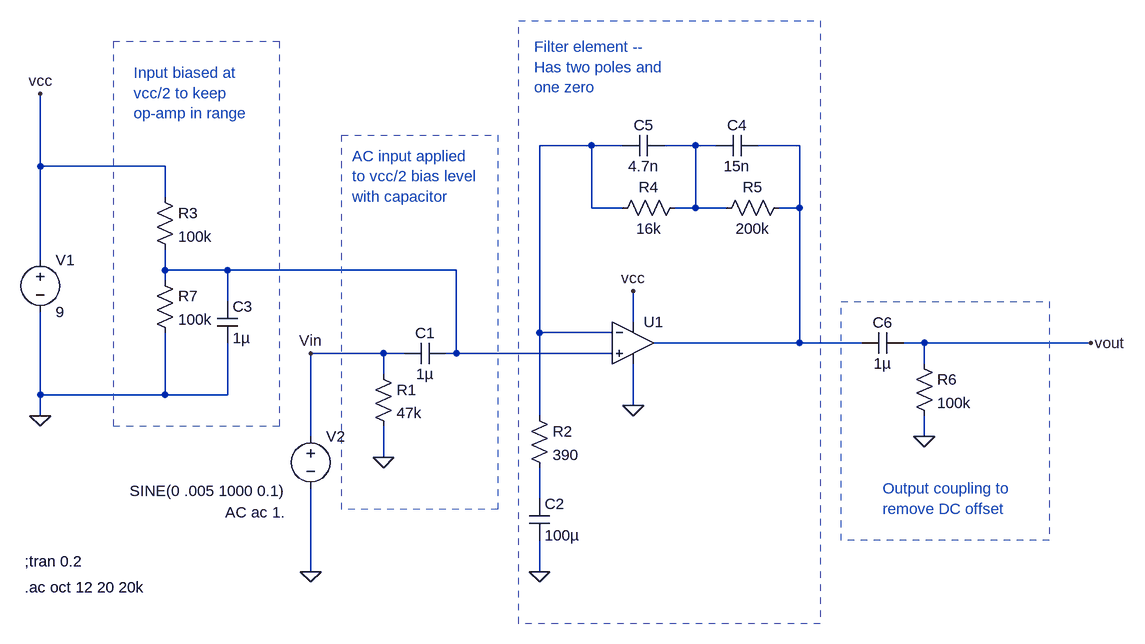
[diagram p0: schematic an-346-noninvert_notated.asc]
an-346-noninvert_notated.asc, the LTspice schematic file:
Version 4
SHEET 1 1740 680
WIRE 672 -256 592 -256
WIRE 720 -256 672 -256
WIRE 832 -256 784 -256
WIRE 864 -256 832 -256
WIRE 992 -256 928 -256
WIRE -176 -224 -176 -336
WIRE 16 -224 -176 -224
WIRE 16 -176 16 -224
WIRE 672 -160 672 -256
WIRE 720 -160 672 -160
WIRE 832 -160 832 -256
WIRE 832 -160 800 -160
WIRE 880 -160 832 -160
WIRE 992 -160 992 -256
WIRE 992 -160 960 -160
WIRE -176 -80 -176 -224
WIRE 16 -64 16 -96
WIRE 112 -64 16 -64
WIRE 464 -64 112 -64
WIRE 16 -48 16 -64
WIRE 112 -16 112 -64
WIRE 736 16 736 -32
WIRE 592 32 592 -256
WIRE 704 32 592 32
WIRE 992 48 992 -160
WIRE 992 48 768 48
WIRE 1088 48 992 48
WIRE 1184 48 1152 48
WIRE 1440 48 1184 48
WIRE 352 64 240 64
WIRE 384 64 352 64
WIRE 464 64 464 -64
WIRE 464 64 448 64
WIRE 704 64 464 64
WIRE 1184 80 1184 48
WIRE 352 96 352 64
WIRE -176 128 -176 0
WIRE 16 128 16 32
WIRE 16 128 -176 128
WIRE 112 128 112 48
WIRE 112 128 16 128
WIRE 736 144 736 80
WIRE 752 144 736 144
WIRE -176 160 -176 128
WIRE 592 160 592 32
WIRE 240 192 240 64
WIRE 1184 192 1184 160
WIRE 352 224 352 176
WIRE 592 288 592 240
WIRE 240 400 240 272
WIRE 592 400 592 352
FLAG -176 160 0
FLAG 240 400 0
FLAG 736 -32 vcc
FLAG -176 -336 vcc
FLAG 352 224 0
FLAG 592 400 0
FLAG 1184 192 0
FLAG 1440 48 vout
FLAG 240 64 Vin
FLAG 736 144 0
SYMBOL voltage -176 -96 R0
WINDOW 123 0 0 Left 2
WINDOW 39 0 0 Left 2
SYMATTR InstName V1
SYMATTR Value 9
SYMBOL voltage 240 176 R0
WINDOW 123 -39 133 Right 2
WINDOW 39 24 152 Left 2
WINDOW 3 -38 100 Right 2
SYMATTR Value2 AC ac 1.
SYMATTR InstName V2
SYMATTR Value SINE(0 .005 1000 0.1)
SYMBOL Opamps\\UniversalOpamp2 736 48 R0
SYMATTR InstName U1
SYMBOL res 336 80 R0
SYMATTR InstName R1
SYMATTR Value 47k
SYMBOL res 576 144 R0
SYMATTR InstName R2
SYMATTR Value 390
SYMBOL res 816 -176 R90
WINDOW 0 0 56 VBottom 2
WINDOW 3 32 56 VTop 2
SYMATTR InstName R4
SYMATTR Value 16k
SYMBOL res 976 -176 R90
WINDOW 0 0 56 VBottom 2
WINDOW 3 32 56 VTop 2
SYMATTR InstName R5
SYMATTR Value 200k
SYMBOL cap 576 288 R0
SYMATTR InstName C2
SYMATTR Value 100µ
SYMBOL cap 928 -272 R90
WINDOW 0 0 32 VBottom 2
WINDOW 3 32 32 VTop 2
SYMATTR InstName C4
SYMATTR Value 15n
SYMBOL cap 784 -272 R90
WINDOW 0 0 32 VBottom 2
WINDOW 3 32 32 VTop 2
SYMATTR InstName C5
SYMATTR Value 4.7n
SYMBOL cap 1152 32 R90
WINDOW 0 0 32 VBottom 2
WINDOW 3 32 32 VTop 2
SYMATTR InstName C6
SYMATTR Value 1µ
SYMBOL res 1168 64 R0
SYMATTR InstName R6
SYMATTR Value 100k
SYMBOL cap 448 48 R90
WINDOW 0 0 32 VBottom 2
WINDOW 3 32 32 VTop 2
SYMATTR InstName C1
SYMATTR Value 1µ
SYMBOL res 0 -192 R0
SYMATTR InstName R3
SYMATTR Value 100k
SYMBOL res 0 -64 R0
SYMATTR InstName R7
SYMATTR Value 100k
SYMBOL cap 96 -16 R0
SYMATTR InstName C3
SYMATTR Value 1µ
TEXT -200 384 Left 2 !;tran 0.2
TEXT -200 424 Left 2 !.ac oct 12 20 20k
TEXT 1120 272 Left 2 ;Output coupling to\nremove DC offset
TEXT -32 -368 Left 2 ;Input biased at\nvcc/2 to keep\nop-amp in range
TEXT 584 -408 Left 2 ;Filter element --\nHas two poles and \none zero
TEXT 304 -240 Left 2 ;AC input applied\nto vcc/2 bias level\nwith capacitor
RECTANGLE Normal 1376 352 1056 -16 2
RECTANGLE Normal 192 -416 -64 176 2
RECTANGLE Normal 528 304 288 -272 2
RECTANGLE Normal 1024 480 560 -448 2

The netlist it stands for:
* an-346-noninvert_notated.asc
V1 vcc 0 9
V2 Vin 0 SINE(0 .005 1000 0.1) AC ac 1.
XU1 N004 N001 vcc 0 N003 level.2 Avol=1Meg GBW=10Meg Slew=10Meg ilimit=25m rail=0 Vos=0 phimargin=45 en=0 enk=0 in=0 ink=0 Rin=500Meg  ; pins IN+ IN- V+ V- OUT
R1 Vin 0 47k
R2 N001 N005 390
R4 N002 N001 16k
R5 N003 N002 200k
C2 N005 0 100µ
C4 N003 N002 15n
C5 N002 N001 4.7n
C6 vout N003 1µ
R6 vout 0 100k
C1 N004 Vin 1µ
R3 vcc N004 100k
R7 N004 0 100k
C3 N004 0 1µ
;tran 0.2
.ac oct 12 20 20k
* Output coupling to
* remove DC offset
* Input biased at
* vcc/2 to keep
* op-amp in range
* Filter element --
* Has two poles and
* one zero
* AC input applied
* to vcc/2 bias level
* with capacitor
.lib UniversalOpamps2.sub
.backanno
.end